# EasyEDA Pro project ESP32_Wroom.eprj, schematic Schematic3
Board Name: Schematic1; Create Date: 2025-12-22; Page Name: P1; Project Name: ESP32_Wroom; Schematic Name: Schematic3; Update Date: 2025-12-22; Company: EasyEDA.com; Page Size: A4; Version: V1.0
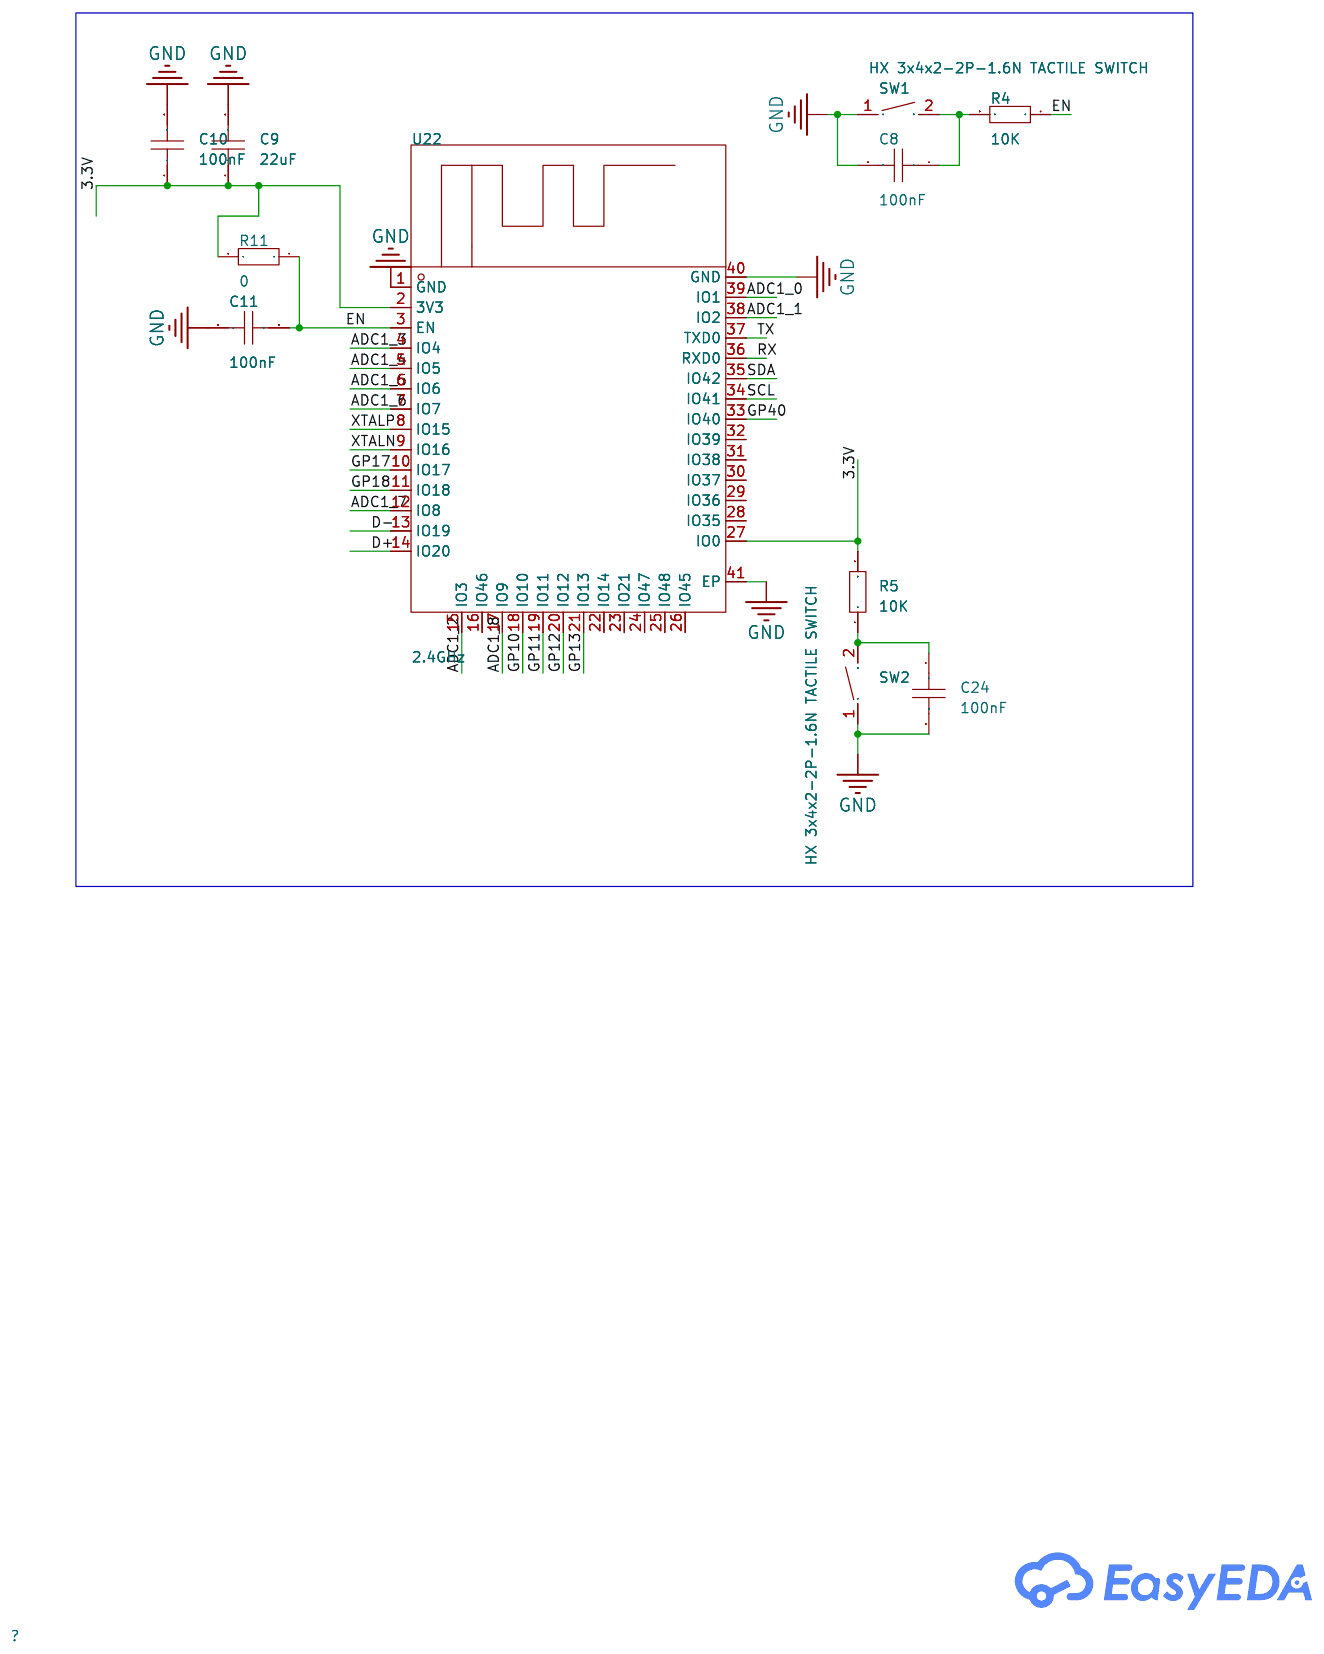
[diagram p2: schematic sheet]

## Parts
C8  100nF  [C0603]
C9  22uF  [C0603]
C10  100nF  [C0603]
C11  100nF  [C0603]
C24  100nF  [C0603]
R4  10K  [R0603]
R5  10K  [R0603]
R11  0  [R0603]
SW1  HX 3x4x2-2P-1.6N TACTILE SWITCH  [KEY-SMD_L4.0-W3.0-LS4.9-1]
SW2  HX 3x4x2-2P-1.6N TACTILE SWITCH  [KEY-SMD_L4.0-W3.0-LS4.9-1]
U22  2.4GHz  [WIFIM-SMD_ESP32-S3-WROOM-1-N8]

## Library data of the parts
C8-C11 C24 = CAP_0603: Supplier Footprint: 0603
R4 R5 R11 = 0603WAF1503T5E: LCSC Part Name: 150kΩ ±1% 100mW 厚膜电阻; Supplier Part: C22807; Manufacturer: UNI-ROYAL(厚声); Supplier Footprint: 0603; JLCPCB Part Class: Basic Part; Datasheet: https://item.szlcsc.com/datasheet/0603WAF1503T5E/23534.html; Supplier: LCSC; Type: Thick Film Resistors; Tolerance: ±1%; Power(Watts): 0.1W; Voltage-Supply(Max): 75V; Temperature Coefficient: ±100ppm/℃; Operating Temperature: -55℃~+155℃
SW1 SW2 = HX 3x4x2-2P-1.6N TACTILE SWITCH: LCSC Part Name: 4*3*2mm 立贴 轻触开关; Supplier Part: C49234124; Manufacturer: hanxia(韩下); Supplier Footprint: SMD; JLCPCB Part Class: Extended Part; Datasheet: https://item.szlcsc.com/datasheet/HX%25203x4x2-2P-1.6N%2520TACTILE%2520SWITCH/51650185.html; Supplier: LCSC; Circuit: SPST; Actuator Style: Round Button; Operating Force: 1.6N; Mounting Type: Surface Mount,Vertical; Length: 4mm; Width: 3mm; Switch Height: 2mm; with Bracket: Without Bracket; Contact Current: 50mA; Voltage Rating: 12V; Actuator/Cap Color: Black; With Lamp: No; Termination Style: SMD(SMT) Tab; Life: 100,000 Cycles
U22 = ESP32-S3-WROOM-1-N8: LCSC Part Name: 通用型Wi-Fi+低功耗蓝牙MCU模组; Supplier Part: C2913198; Manufacturer: ESPRESSIF(乐鑫); Supplier Footprint: SMD,18x25.5mm; JLCPCB Part Class: Extended Part; Datasheet: https://atta.szlcsc.com/upload/public/pdf/source/20221026/9A44C6421221D672346AAE72DF9F8146.pdf; Supplier: LCSC; Core Processor: ESP32-S3 Chip; Support Interface: I2C；GPIO；SPI；PWM；ADC；UART；USB；I2S

## Nets
3.3V: C9.1 C10.1 R5.2 R11.2 U22.2(3V3) U22.27(IO0)
GND: C8.2 C9.2 C10.2 C11.2 C24.2 SW1.1 SW2.1 U22.1(GND) U22.40(GND) U22.41(EP)
ADC1_0: U22.39(IO1)
ADC1_1: U22.38(IO2)
ADC1_2: U22.15(IO3)
ADC1_3: U22.4(IO4)
ADC1_4: U22.5(IO5)
ADC1_5: U22.6(IO6)
ADC1_6: U22.7(IO7)
ADC1_7: U22.12(IO8)
ADC1_8: U22.17(IO9)
D+: U22.14(IO20)
D-: U22.13(IO19)
EN: C11.1 R4.1 R11.1 U22.3(EN)
GP10: U22.18(IO10)
GP11: U22.19(IO11)
GP12: U22.20(IO12)
GP13: U22.21(IO13)
GP17: U22.10(IO17)
GP18: U22.11(IO18)
GP40: U22.33(IO40)
RX: U22.36(RXD0)
SCL: U22.34(IO41)
SDA: U22.35(IO42)
TX: U22.37(TXD0)
XTALN: U22.9(IO16)
XTALP: U22.8(IO15)
Net-(C8-1): C8.1 R4.2 SW1.2
Net-(C24-1): C24.1 R5.1 SW2.2

Not connected (* = marked no-connect by the designer): U22 16(IO46) 22(IO14) 23(IO21) 24(IO47) 25(IO48) 26(IO45) 28(IO35) 29(IO36) 30(IO37) 31(IO38) 32(IO39)
